# EAGLE design untitled (EAGLE 5.11)
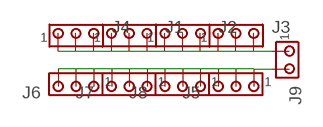
[diagram p0: schematic, sheet 1]

## Parts
J1  MTA03-156  [1X3MTA]
J2  MTA03-156  [1X3MTA]
J3  MTA03-156  [1X3MTA]
J4  MTA03-156  [1X3MTA]
J5  MTA03-156  [1X3MTA]
J6  MTA03-156  [1X3MTA]
J7  MTA03-156  [1X3MTA]
J8  MTA03-156  [1X3MTA]
J9  MTA02-156  [1X2MTA]

## Nets
N$3: J1.1 J1.2 J1.3 J2.1 J2.2 J2.3 J3.1 J3.2 J3.3 J4.1 J4.2 J4.3 J9.1
N$4: J5.1 J5.2 J5.3 J6.1 J6.2 J6.3 J7.1 J7.2 J7.3 J8.1 J8.2 J8.3 J9.2

## Library data of the parts
J1-J8 = con-amp:MTA03-156: AMP connector; OC_FARNELL: unknown; OC_NEWARK: unknown
J9 = con-amp:MTA02-156: AMP connector; OC_FARNELL: unknown; OC_NEWARK: unknown

## Board
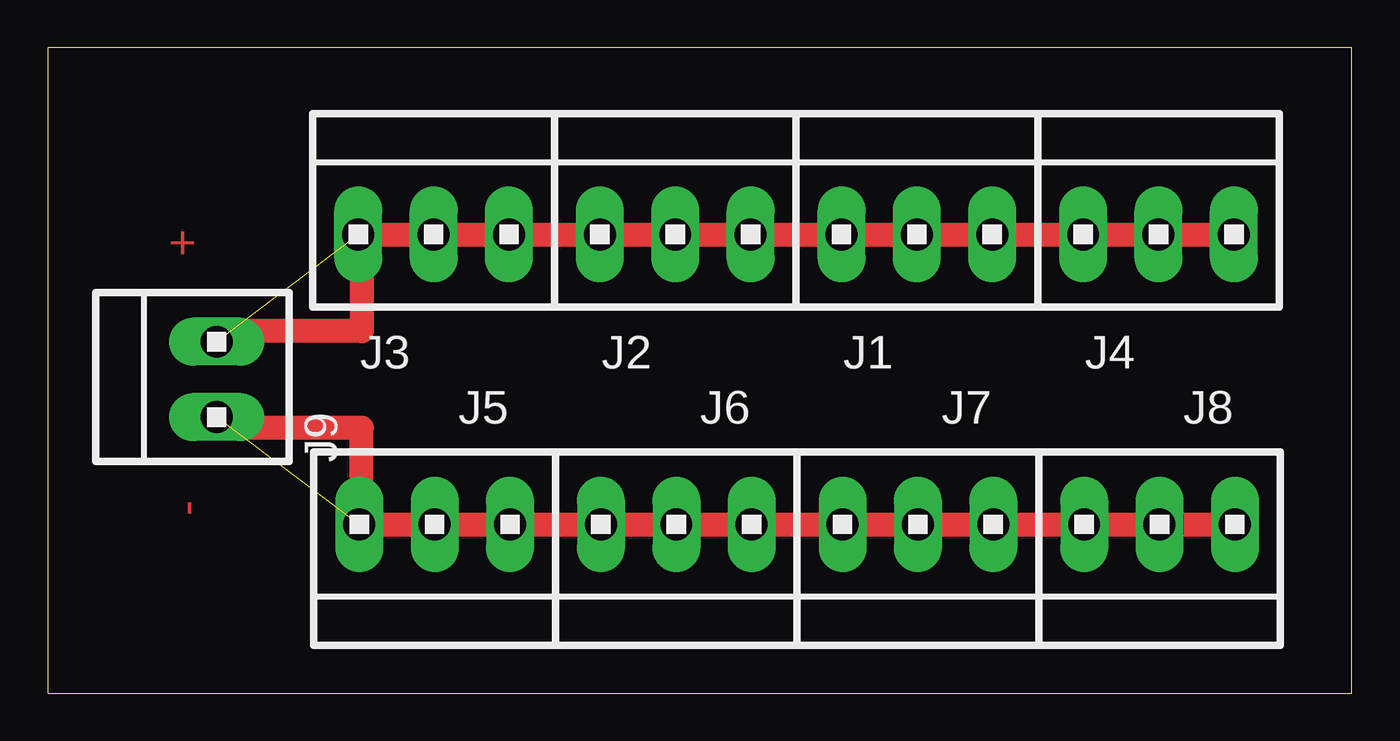
[diagram p1: board, top side]

Size 68.56 x 33.96 mm. Coordinates in mm from the lower left corner, seen from the top.
Outline: 0,0 68.56,0 68.56,33.96 0,33.96 0,0
Copper layers (1*16): Top 0.035mm / dielectric 1.5mm / Bottom 0.035mm
Design rules "default": minimum track width 10mil, minimum drill 24mil, track to track 8mil, track to pad 8mil, pad to pad 8mil, via to via 8mil, smd to smd 8mil, copper to edge 40mil, drill to drill 8mil, minimum pad ring 10mil, minimum via ring 8mil, stop-mask expansion 4mil, vias tented up to drill 0mil, thermal gap 10mil

### Footprints (pad centres in the part's own frame; a part is rotated, then mirrored left to right if it is on the bottom)
1X3MTA = drill 1.676 long: 1 3.937,0; 2 -0.025,0; 3 -3.988,0
1X2MTA = drill 1.676 long: 1 1.981,0; 2 -1.981,0

### Placement (x,y rotation side)
J1  45.72,24.13 0 top
J2  33.02,24.13 0 top
J3  20.32,24.13 0 top
J4  58.42,24.13 0 top
J5  20.32,8.89 180 top
J6  33.02,8.89 180 top
J7  45.72,8.89 180 top
J8  58.42,8.89 180 top
J9  8.89,16.51 90 top

### Tracks (layer width: path | path; a pad name or v marks a point on that pad's centre or on a via)
N$3  (via drill 0.6)  (1 unrouted)
  Top 0.254: J3.3 v16.51,24.13
  Top 0.406: 10.16,19.05 8.89,19.05 8.89,17.78 10.16,17.78 10.16,19.05
  Top 1.27: J4.1 J4.2 J4.3 J1.1 J1.2 J1.3 J2.1 J2.2 J2.3 J3.1 J3.2 v16.51,24.13 16.51,19.05 10.16,19.05
N$4  (via drill 0.6)  (1 unrouted)
  Top 0.254: J5.1 v16.51,8.89
  Top 0.406: 10.16,13.97 8.89,13.97 8.89,15.24 10.16,15.24 10.16,13.97
  Top 1.27: J8.3 J8.2 J8.1 J7.3 J7.2 J7.1 J6.3 J6.2 J6.1 J5.3 J5.2 v16.51,8.89 16.51,13.97 10.16,13.97

### Text on the board
Top: + | -